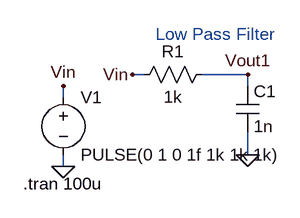
[diagram p0: schematic Low Pass Filter.asc]
Low Pass Filter.asc, the LTspice schematic file:
Version 4
SHEET 1 880 680
WIRE 16 96 0 96
WIRE 160 96 96 96
WIRE 160 112 160 96
WIRE -96 128 -96 112
WIRE 160 208 160 176
WIRE -96 224 -96 208
FLAG -96 224 0
FLAG 160 208 0
FLAG -96 112 Vin
FLAG 160 96 Vout1
FLAG 0 96 Vin
SYMBOL res 112 80 R90
WINDOW 0 0 56 VBottom 2
WINDOW 3 32 56 VTop 2
SYMATTR InstName R1
SYMATTR Value 1k
SYMBOL cap 144 112 R0
SYMATTR InstName C1
SYMATTR Value 1n
SYMBOL voltage -96 112 R0
WINDOW 123 0 0 Left 2
WINDOW 39 0 0 Left 2
SYMATTR InstName V1
SYMATTR Value PULSE(0 1 0 1f 1k 1k 1k)
TEXT -152 248 Left 2 !.tran 100u
TEXT 32 40 Left 2 ;Low Pass Filter

The netlist it stands for:
* Low Pass Filter.asc
R1 Vout1 Vin 1k
C1 Vout1 0 1n
V1 Vin 0 PULSE(0 1 0 1f 1k 1k 1k)
.tran 100u
* Low Pass Filter
.backanno
.end